# EAGLE schematic switch_strip (EAGLE 9.2.2)
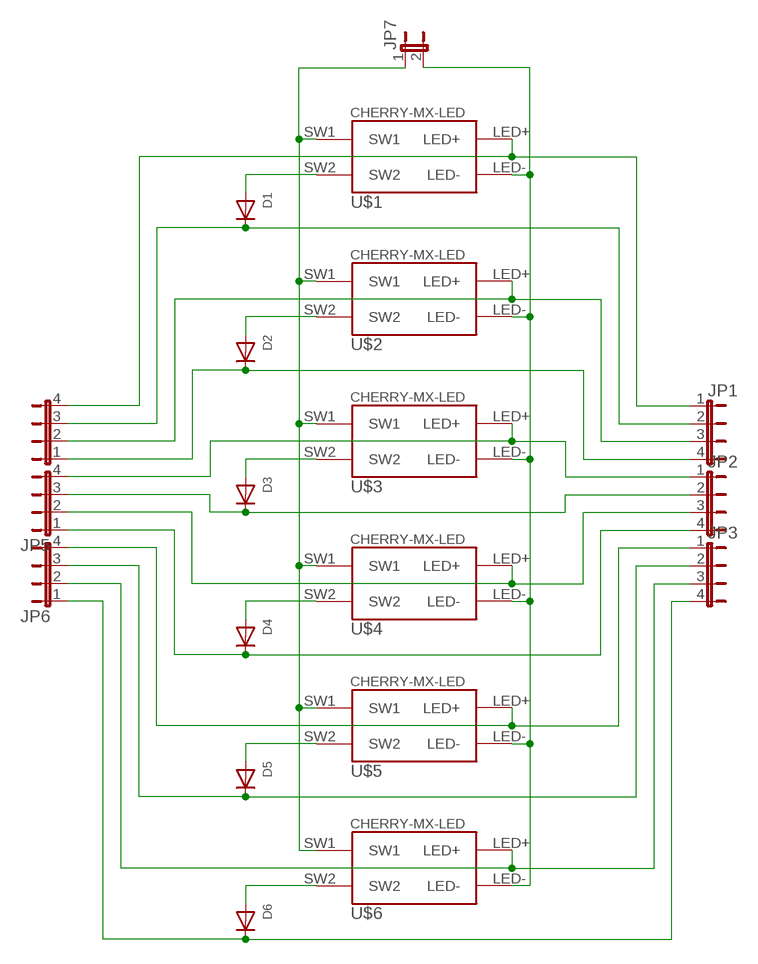
[diagram p0: schematic, sheet 1]

## Parts
D1  DIODEDO-1N4148  [DO-1N4148]
D2  DIODEDO-1N4148  [DO-1N4148]
D3  DIODEDO-1N4148  [DO-1N4148]
D4  DIODEDO-1N4148  [DO-1N4148]
D5  DIODEDO-1N4148  [DO-1N4148]
D6  DIODEDO-1N4148  [DO-1N4148]
JP1  JP4E  [JP4]
JP2  JP4E  [JP4]
JP3  JP4E  [JP4]
JP4  JP4E  [JP4]
JP5  JP4E  [JP4]
JP6  JP4E  [JP4]
JP7  JP1E  [JP1]
U$1  CHERRY-MX-LED  [CHERRY-MX-LED]
U$2  CHERRY-MX-LED  [CHERRY-MX-LED]
U$3  CHERRY-MX-LED  [CHERRY-MX-LED]
U$4  CHERRY-MX-LED  [CHERRY-MX-LED]
U$5  CHERRY-MX-LED  [CHERRY-MX-LED]
U$6  CHERRY-MX-LED  [CHERRY-MX-LED]

## Nets
N$1: JP7.1 U$1.SW1 U$2.SW1 U$3.SW1 U$4.SW1 U$5.SW1 U$6.SW1
N$2: D6.A U$6.SW2
N$3: D5.A U$5.SW2
N$4: D4.A U$4.SW2
N$5: D3.A U$3.SW2
N$6: D2.A U$2.SW2
N$7: D1.A U$1.SW2
N$8: JP7.2 U$1.LED- U$2.LED- U$3.LED- U$4.LED- U$5.LED- U$6.LED-
N$9: JP1.1 JP4.4 U$1.LED+
N$10: D1.C JP1.2 JP4.3
N$11: JP1.3 JP4.2 U$2.LED+
N$12: D2.C JP1.4 JP4.1
N$13: JP2.1 JP5.4 U$3.LED+
N$14: D3.C JP2.2 JP5.3
N$15: JP2.3 JP5.2 U$4.LED+
N$16: D4.C JP2.4 JP5.1
N$17: JP3.1 JP6.4 U$5.LED+
N$18: D5.C JP3.2 JP6.3
N$19: JP3.3 JP6.2 U$6.LED+
N$20: D6.C JP3.4 JP6.1

## Library data of the parts
D1-D6 = adafruit:DIODE: Diode SMADIODE - SMA Surface Mount Package 20V 1A Schottky Diode Digikey: 641-1014-6-ND DO-1N4148 - Through Hole Small Current Diode SOD-123 20V 1 A (.5mV Vf) Schottky Diode - Digikey: MBRX120TPMSCT-ND SOD-323 10V 570mA (.38mV Vf, 3ns) Schottky Diode - Digikey: ZLLS410CT-ND SOD-523 30V 30mA Schottky Diode (RB751S-40TE61) - Digikey: RB751S-40TE61CT-ND SOT23-R/W - SOT23 Package (R = Solder Paste/Reflow Ovens, W = Hand-Soldering) BAT54Film 40V 300mA - Digikey: 497-7162-1-ND
JP1-JP6 = jumper:JP4E: JUMPER
JP7 = jumper:JP1E: JUMPER
U$1-U$6 = cherrymx:CHERRY-MX-LED: Cherry MX series keyswitch with LED